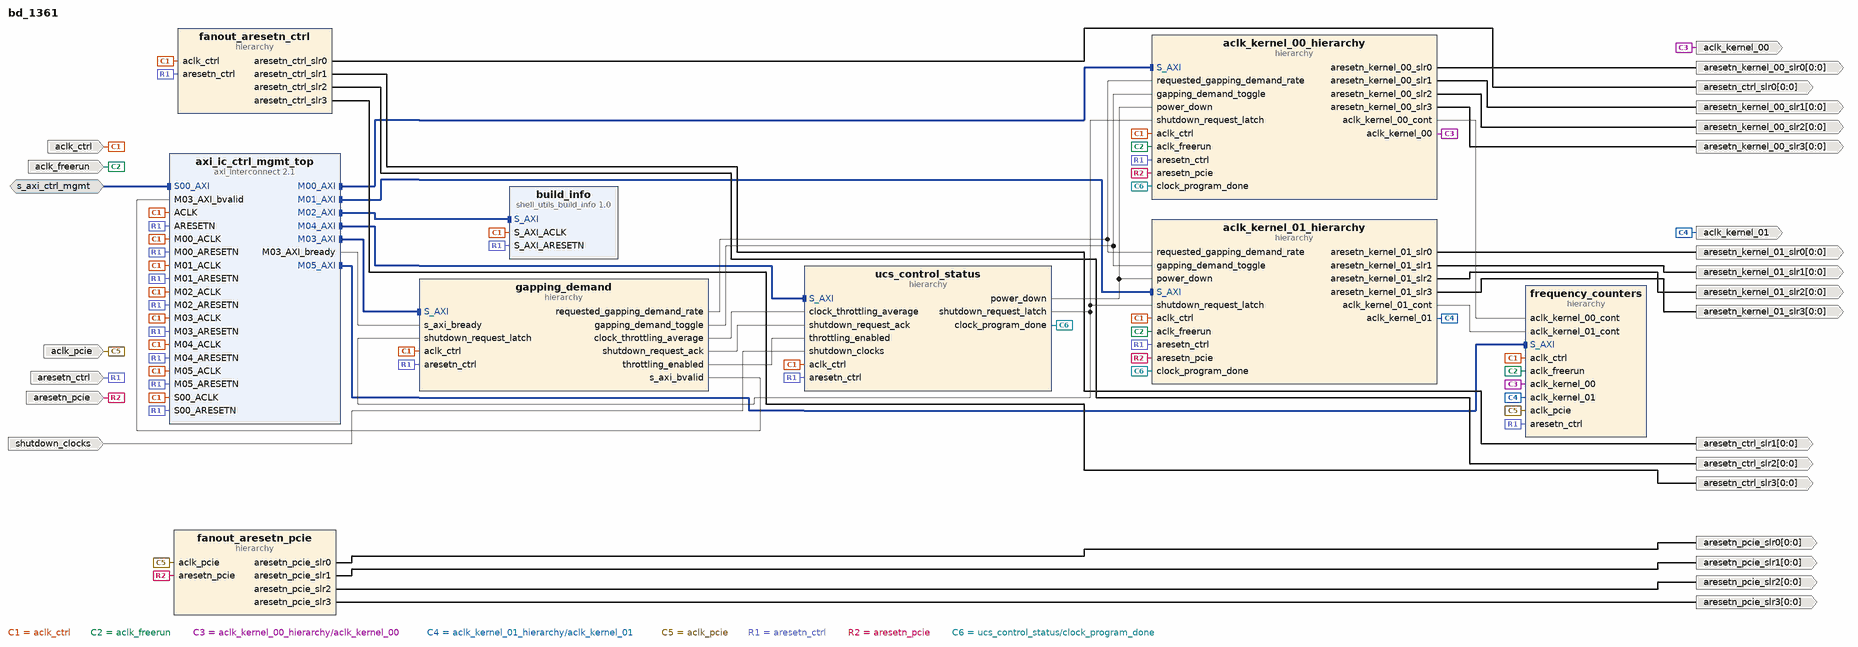
[diagram p0: block diagram of the top level]
# Vivado block design bd_1361, xcu250-figd2104-2L-e, Vivado 2022.2
create_bd_design bd_1361

create_bd_intf_port -mode Slave -vlnv xilinx.com:interface:aximm_rtl:1.0 s_axi_ctrl_mgmt
set_property -dict [list \
  CONFIG.ADDR_WIDTH 24 \
  CONFIG.DATA_WIDTH 32 \
  CONFIG.INSERT_VIP 1 \
  CONFIG.MAX_BURST_LENGTH 1 \
  CONFIG.PROTOCOL AXI4LITE \
  CONFIG.SUPPORTS_NARROW_BURST 0 \
] [get_bd_intf_ports s_axi_ctrl_mgmt]
create_bd_port -dir I -type clk aclk_freerun
set_property -dict {CONFIG.FREQ_HZ 100000000} [get_bd_ports aclk_freerun]
create_bd_port -dir I -type clk aclk_ctrl
set_property -dict [list \
  CONFIG.ASSOCIATED_BUSIF s_axi_ctrl_mgmt \
  CONFIG.ASSOCIATED_RESET aresetn_ctrl:aresetn_ctrl_slr0:aresetn_ctrl_slr1:aresetn_ctrl_slr2:aresetn_ctrl_slr3 \
] [get_bd_ports aclk_ctrl]
create_bd_port -dir I -type clk aclk_pcie
set_property -dict [list \
  CONFIG.ASSOCIATED_RESET aresetn_pcie:aresetn_pcie_slr0:aresetn_pcie_slr1:aresetn_pcie_slr2:aresetn_pcie_slr3 \
  CONFIG.FREQ_HZ 250000000 \
] [get_bd_ports aclk_pcie]
create_bd_port -dir O -type clk aclk_kernel_00
set_property -dict [list \
  CONFIG.ASSOCIATED_RESET aresetn_kernel_00_slr0:aresetn_kernel_00_slr1:aresetn_kernel_00_slr2:aresetn_kernel_00_slr3 \
] [get_bd_ports aclk_kernel_00]
create_bd_port -dir O -type clk aclk_kernel_01
set_property -dict [list \
  CONFIG.ASSOCIATED_RESET aresetn_kernel_01_slr0:aresetn_kernel_01_slr1:aresetn_kernel_01_slr2:aresetn_kernel_01_slr3 \
] [get_bd_ports aclk_kernel_01]
create_bd_port -dir I -type rst aresetn_ctrl
create_bd_port -dir I -type rst aresetn_pcie
create_bd_port -dir O -from 0 -to 0 -type rst aresetn_ctrl_slr0
create_bd_port -dir O -from 0 -to 0 -type rst aresetn_ctrl_slr1
create_bd_port -dir O -from 0 -to 0 -type rst aresetn_ctrl_slr2
create_bd_port -dir O -from 0 -to 0 -type rst aresetn_ctrl_slr3
create_bd_port -dir O -from 0 -to 0 -type rst aresetn_pcie_slr0
create_bd_port -dir O -from 0 -to 0 -type rst aresetn_pcie_slr1
create_bd_port -dir O -from 0 -to 0 -type rst aresetn_pcie_slr2
create_bd_port -dir O -from 0 -to 0 -type rst aresetn_pcie_slr3
create_bd_port -dir O -from 0 -to 0 -type rst aresetn_kernel_00_slr0
create_bd_port -dir O -from 0 -to 0 -type rst aresetn_kernel_00_slr1
create_bd_port -dir O -from 0 -to 0 -type rst aresetn_kernel_00_slr2
create_bd_port -dir O -from 0 -to 0 -type rst aresetn_kernel_00_slr3
create_bd_port -dir O -from 0 -to 0 -type rst aresetn_kernel_01_slr0
create_bd_port -dir O -from 0 -to 0 -type rst aresetn_kernel_01_slr1
create_bd_port -dir O -from 0 -to 0 -type rst aresetn_kernel_01_slr2
create_bd_port -dir O -from 0 -to 0 -type rst aresetn_kernel_01_slr3
create_bd_port -dir I shutdown_clocks

create_bd_cell -type ip -vlnv xilinx.com:ip:axi_interconnect:2.1 axi_ic_ctrl_mgmt_top
set_property -dict {CONFIG.NUM_MI 6} [get_bd_cells axi_ic_ctrl_mgmt_top]
create_bd_cell -type ip -vlnv xilinx.com:ip:shell_utils_build_info:1.0 build_info
set_property -dict [list \
  CONFIG.C_CORE_REVISION 5 \
  CONFIG.C_MAJOR_VERSION 3 \
  CONFIG.C_MINOR_VERSION 0 \
  CONFIG.C_PATCH_REVISION 0 \
  CONFIG.C_PERFORCE_CL 3478949 \
  CONFIG.C_RESERVED_TAG 0x00000000 \
  CONFIG.C_SUBSYSTEM_ID 0x07 \
  CONFIG.C_VIV_VERSION 0x202210 \
] [get_bd_cells build_info]
create_bd_cell -type hier gapping_demand
create_bd_cell -type hier ucs_control_status
create_bd_cell -type hier fanout_aresetn_pcie
create_bd_cell -type hier fanout_aresetn_ctrl
create_bd_cell -type hier frequency_counters
create_bd_cell -type hier aclk_kernel_00_hierarchy
create_bd_cell -type hier aclk_kernel_01_hierarchy

# ---- hierarchy /gapping_demand ----
current_bd_instance /gapping_demand
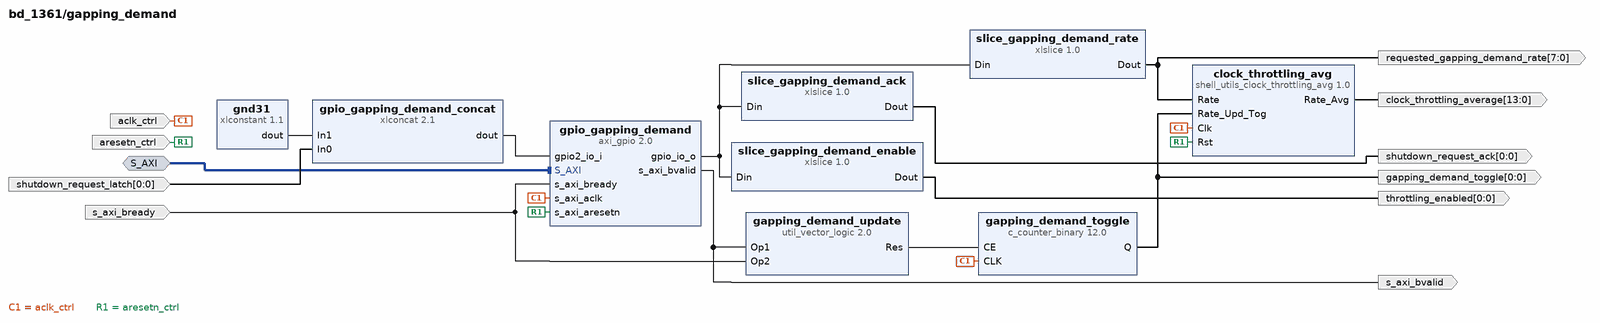
[diagram p1: block diagram inside /gapping_demand]
create_bd_intf_pin -mode Slave -vlnv xilinx.com:interface:aximm_rtl:1.0 S_AXI
create_bd_pin -dir I -type clk aclk_ctrl
create_bd_pin -dir I -type rst aresetn_ctrl
create_bd_pin -dir I s_axi_bready
create_bd_pin -dir O -from 0 -to 0 -type data gapping_demand_toggle
create_bd_pin -dir O -from 7 -to 0 requested_gapping_demand_rate
create_bd_pin -dir O s_axi_bvalid
create_bd_pin -dir O -from 13 -to 0 clock_throttling_average
create_bd_pin -dir I -from 0 -to 0 shutdown_request_latch
create_bd_pin -dir O -from 0 -to 0 shutdown_request_ack
create_bd_pin -dir O -from 0 -to 0 throttling_enabled

create_bd_cell -type ip -vlnv xilinx.com:ip:c_counter_binary:12.0 gapping_demand_toggle
set_property -dict {CONFIG.CE true CONFIG.Output_Width 1} [get_bd_cells gapping_demand_toggle]
create_bd_cell -type ip -vlnv xilinx.com:ip:util_vector_logic:2.0 gapping_demand_update
set_property -dict {CONFIG.C_SIZE 1} [get_bd_cells gapping_demand_update]
create_bd_cell -type ip -vlnv xilinx.com:ip:xlconstant:1.1 gnd31
set_property -dict {CONFIG.CONST_WIDTH 31} [get_bd_cells gnd31]
create_bd_cell -type ip -vlnv xilinx.com:ip:axi_gpio:2.0 gpio_gapping_demand
set_property -dict [list \
  CONFIG.C_ALL_INPUTS_2 1 \
  CONFIG.C_ALL_OUTPUTS 1 \
  CONFIG.C_DOUT_DEFAULT 0x000000FF \
  CONFIG.C_IS_DUAL 1 \
] [get_bd_cells gpio_gapping_demand]
create_bd_cell -type ip -vlnv xilinx.com:ip:xlconcat:2.1 gpio_gapping_demand_concat
set_property -dict {CONFIG.IN0_WIDTH 1 CONFIG.IN1_WIDTH 31 CONFIG.NUM_PORTS 2} [get_bd_cells gpio_gapping_demand_concat]
create_bd_cell -type ip -vlnv xilinx.com:ip:xlslice:1.0 slice_gapping_demand_rate
set_property -dict {CONFIG.DIN_FROM 7 CONFIG.DIN_TO 0 CONFIG.DOUT_WIDTH 8} [get_bd_cells slice_gapping_demand_rate]
create_bd_cell -type ip -vlnv xilinx.com:ip:xlslice:1.0 slice_gapping_demand_ack
set_property -dict {CONFIG.DIN_FROM 16 CONFIG.DIN_TO 16 CONFIG.DOUT_WIDTH 1} [get_bd_cells slice_gapping_demand_ack]
create_bd_cell -type ip -vlnv xilinx.com:ip:xlslice:1.0 slice_gapping_demand_enable
set_property -dict {CONFIG.DIN_FROM 20 CONFIG.DIN_TO 20 CONFIG.DOUT_WIDTH 1} [get_bd_cells slice_gapping_demand_enable]
create_bd_cell -type ip -vlnv xilinx.com:ip:shell_utils_clock_throttling_avg:1.0 clock_throttling_avg

# ---- hierarchy /ucs_control_status ----
current_bd_instance /ucs_control_status
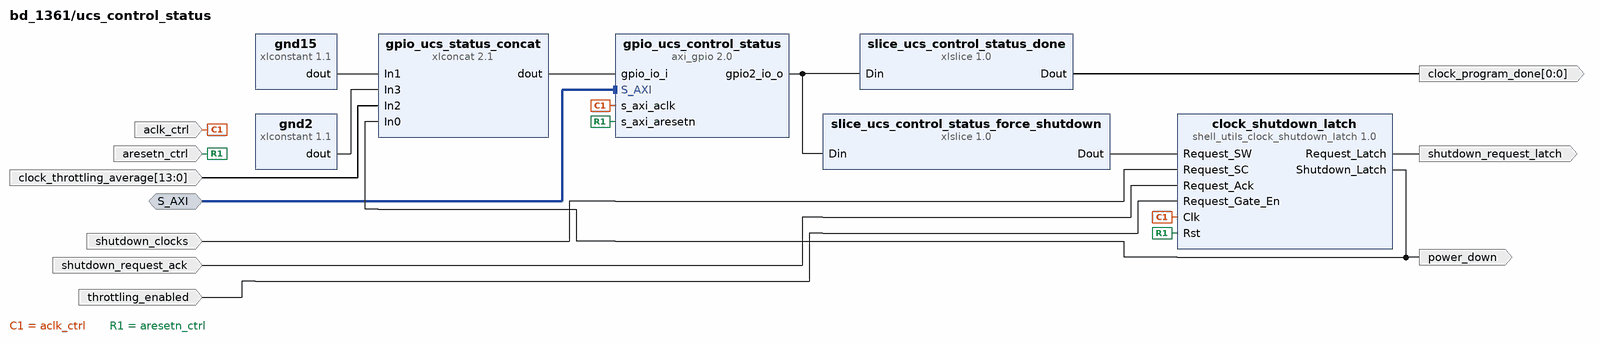
[diagram p2: block diagram inside /ucs_control_status]
create_bd_intf_pin -mode Slave -vlnv xilinx.com:interface:aximm_rtl:1.0 S_AXI
create_bd_pin -dir I -type clk aclk_ctrl
create_bd_pin -dir I -type rst aresetn_ctrl
create_bd_pin -dir I -from 13 -to 0 clock_throttling_average
create_bd_pin -dir O -from 0 -to 0 clock_program_done
create_bd_pin -dir I shutdown_clocks
create_bd_pin -dir I shutdown_request_ack
create_bd_pin -dir I throttling_enabled
create_bd_pin -dir O power_down
create_bd_pin -dir O shutdown_request_latch

create_bd_cell -type ip -vlnv xilinx.com:ip:xlconstant:1.1 gnd2
set_property -dict {CONFIG.CONST_VAL 0 CONFIG.CONST_WIDTH 2} [get_bd_cells gnd2]
create_bd_cell -type ip -vlnv xilinx.com:ip:xlconstant:1.1 gnd15
set_property -dict {CONFIG.CONST_VAL 0 CONFIG.CONST_WIDTH 15} [get_bd_cells gnd15]
create_bd_cell -type ip -vlnv xilinx.com:ip:axi_gpio:2.0 gpio_ucs_control_status
set_property -dict {CONFIG.C_ALL_INPUTS 1 CONFIG.C_ALL_OUTPUTS_2 1 CONFIG.C_IS_DUAL 1} [get_bd_cells gpio_ucs_control_status]
create_bd_cell -type ip -vlnv xilinx.com:ip:xlconcat:2.1 gpio_ucs_status_concat
set_property -dict [list \
  CONFIG.IN0_WIDTH 1 \
  CONFIG.IN1_WIDTH 15 \
  CONFIG.IN2_WIDTH 14 \
  CONFIG.IN3_WIDTH 2 \
  CONFIG.NUM_PORTS 4 \
] [get_bd_cells gpio_ucs_status_concat]
create_bd_cell -type ip -vlnv xilinx.com:ip:xlslice:1.0 slice_ucs_control_status_done
set_property -dict {CONFIG.DIN_FROM 0 CONFIG.DIN_TO 0 CONFIG.DOUT_WIDTH 1} [get_bd_cells slice_ucs_control_status_done]
create_bd_cell -type ip -vlnv xilinx.com:ip:shell_utils_clock_shutdown_latch:1.0 clock_shutdown_latch
create_bd_cell -type ip -vlnv xilinx.com:ip:xlslice:1.0 slice_ucs_control_status_force_shutdown
set_property -dict [list \
  CONFIG.DIN_FROM 20 \
  CONFIG.DIN_TO 5 \
  CONFIG.DOUT_WIDTH 16 \
] [get_bd_cells slice_ucs_control_status_force_shutdown]

# ---- hierarchy /fanout_aresetn_pcie ----
current_bd_instance /fanout_aresetn_pcie
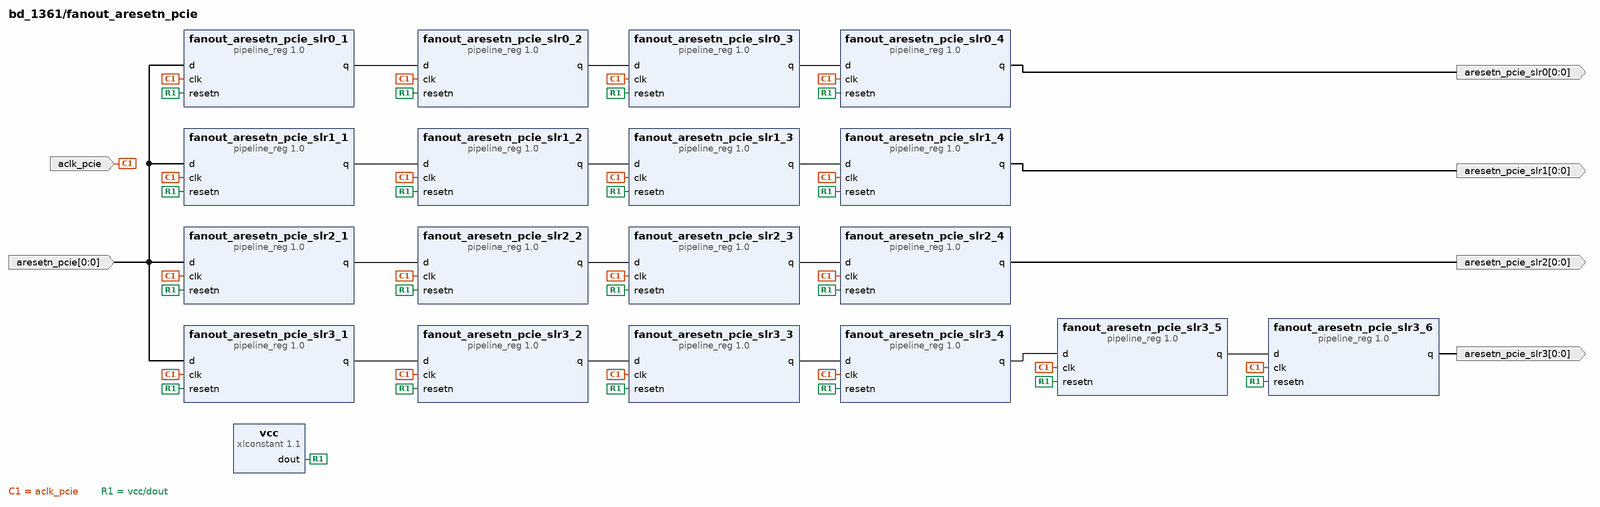
[diagram p3: block diagram inside /fanout_aresetn_pcie]
create_bd_pin -dir I -type clk aclk_pcie
create_bd_pin -dir I -from 0 -to 0 aresetn_pcie
create_bd_pin -dir O -from 0 -to 0 aresetn_pcie_slr0
create_bd_pin -dir O -from 0 -to 0 aresetn_pcie_slr1
create_bd_pin -dir O -from 0 -to 0 aresetn_pcie_slr2
create_bd_pin -dir O -from 0 -to 0 aresetn_pcie_slr3

create_bd_cell -type ip -vlnv xilinx.com:ip:pipeline_reg:1.0 fanout_aresetn_pcie_slr0_1
create_bd_cell -type ip -vlnv xilinx.com:ip:pipeline_reg:1.0 fanout_aresetn_pcie_slr0_2
create_bd_cell -type ip -vlnv xilinx.com:ip:pipeline_reg:1.0 fanout_aresetn_pcie_slr0_3
create_bd_cell -type ip -vlnv xilinx.com:ip:pipeline_reg:1.0 fanout_aresetn_pcie_slr0_4
create_bd_cell -type ip -vlnv xilinx.com:ip:pipeline_reg:1.0 fanout_aresetn_pcie_slr1_1
create_bd_cell -type ip -vlnv xilinx.com:ip:pipeline_reg:1.0 fanout_aresetn_pcie_slr1_2
create_bd_cell -type ip -vlnv xilinx.com:ip:pipeline_reg:1.0 fanout_aresetn_pcie_slr1_3
create_bd_cell -type ip -vlnv xilinx.com:ip:pipeline_reg:1.0 fanout_aresetn_pcie_slr1_4
create_bd_cell -type ip -vlnv xilinx.com:ip:pipeline_reg:1.0 fanout_aresetn_pcie_slr2_1
create_bd_cell -type ip -vlnv xilinx.com:ip:pipeline_reg:1.0 fanout_aresetn_pcie_slr2_2
create_bd_cell -type ip -vlnv xilinx.com:ip:pipeline_reg:1.0 fanout_aresetn_pcie_slr2_3
create_bd_cell -type ip -vlnv xilinx.com:ip:pipeline_reg:1.0 fanout_aresetn_pcie_slr2_4
create_bd_cell -type ip -vlnv xilinx.com:ip:pipeline_reg:1.0 fanout_aresetn_pcie_slr3_1
create_bd_cell -type ip -vlnv xilinx.com:ip:pipeline_reg:1.0 fanout_aresetn_pcie_slr3_2
create_bd_cell -type ip -vlnv xilinx.com:ip:pipeline_reg:1.0 fanout_aresetn_pcie_slr3_3
create_bd_cell -type ip -vlnv xilinx.com:ip:pipeline_reg:1.0 fanout_aresetn_pcie_slr3_4
create_bd_cell -type ip -vlnv xilinx.com:ip:pipeline_reg:1.0 fanout_aresetn_pcie_slr3_5
create_bd_cell -type ip -vlnv xilinx.com:ip:pipeline_reg:1.0 fanout_aresetn_pcie_slr3_6
create_bd_cell -type ip -vlnv xilinx.com:ip:xlconstant:1.1 vcc
set_property -dict {CONFIG.CONST_VAL 1} [get_bd_cells vcc]

# ---- hierarchy /fanout_aresetn_ctrl ----
current_bd_instance /fanout_aresetn_ctrl
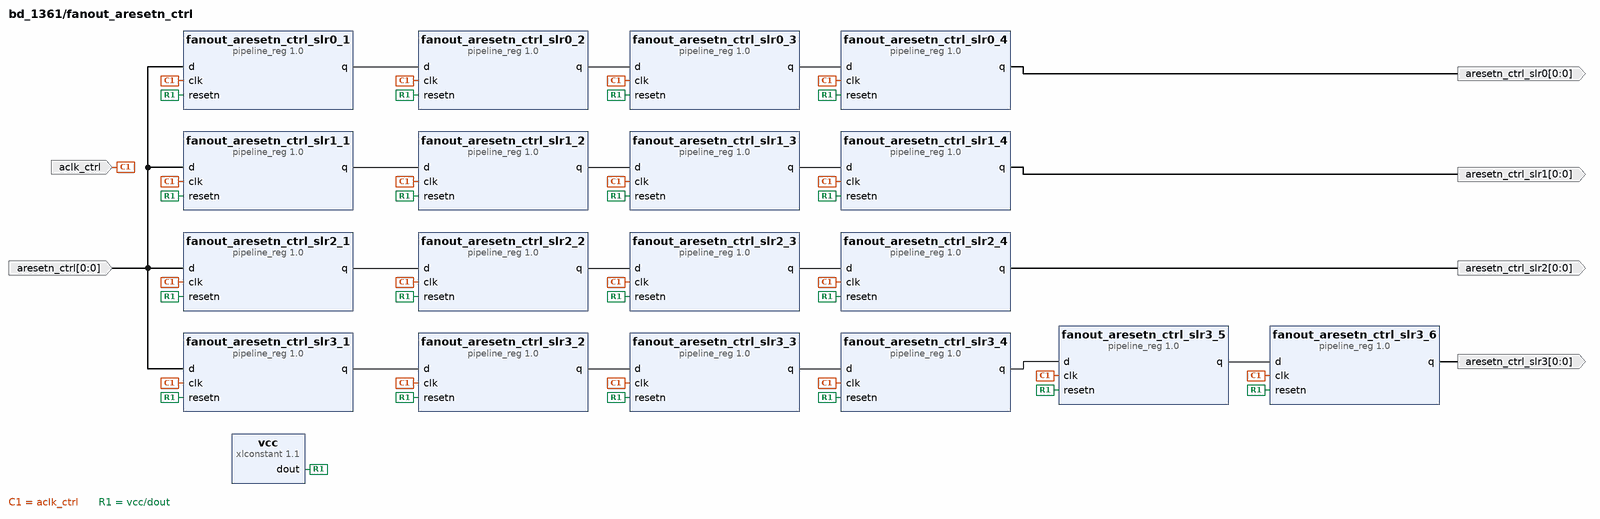
[diagram p4: block diagram inside /fanout_aresetn_ctrl]
create_bd_pin -dir I -type clk aclk_ctrl
create_bd_pin -dir I -from 0 -to 0 aresetn_ctrl
create_bd_pin -dir O -from 0 -to 0 aresetn_ctrl_slr0
create_bd_pin -dir O -from 0 -to 0 aresetn_ctrl_slr1
create_bd_pin -dir O -from 0 -to 0 aresetn_ctrl_slr2
create_bd_pin -dir O -from 0 -to 0 aresetn_ctrl_slr3

create_bd_cell -type ip -vlnv xilinx.com:ip:pipeline_reg:1.0 fanout_aresetn_ctrl_slr0_1
create_bd_cell -type ip -vlnv xilinx.com:ip:pipeline_reg:1.0 fanout_aresetn_ctrl_slr0_2
create_bd_cell -type ip -vlnv xilinx.com:ip:pipeline_reg:1.0 fanout_aresetn_ctrl_slr0_3
create_bd_cell -type ip -vlnv xilinx.com:ip:pipeline_reg:1.0 fanout_aresetn_ctrl_slr0_4
create_bd_cell -type ip -vlnv xilinx.com:ip:pipeline_reg:1.0 fanout_aresetn_ctrl_slr1_1
create_bd_cell -type ip -vlnv xilinx.com:ip:pipeline_reg:1.0 fanout_aresetn_ctrl_slr1_2
create_bd_cell -type ip -vlnv xilinx.com:ip:pipeline_reg:1.0 fanout_aresetn_ctrl_slr1_3
create_bd_cell -type ip -vlnv xilinx.com:ip:pipeline_reg:1.0 fanout_aresetn_ctrl_slr1_4
create_bd_cell -type ip -vlnv xilinx.com:ip:pipeline_reg:1.0 fanout_aresetn_ctrl_slr2_1
create_bd_cell -type ip -vlnv xilinx.com:ip:pipeline_reg:1.0 fanout_aresetn_ctrl_slr2_2
create_bd_cell -type ip -vlnv xilinx.com:ip:pipeline_reg:1.0 fanout_aresetn_ctrl_slr2_3
create_bd_cell -type ip -vlnv xilinx.com:ip:pipeline_reg:1.0 fanout_aresetn_ctrl_slr2_4
create_bd_cell -type ip -vlnv xilinx.com:ip:pipeline_reg:1.0 fanout_aresetn_ctrl_slr3_1
create_bd_cell -type ip -vlnv xilinx.com:ip:pipeline_reg:1.0 fanout_aresetn_ctrl_slr3_2
create_bd_cell -type ip -vlnv xilinx.com:ip:pipeline_reg:1.0 fanout_aresetn_ctrl_slr3_3
create_bd_cell -type ip -vlnv xilinx.com:ip:pipeline_reg:1.0 fanout_aresetn_ctrl_slr3_4
create_bd_cell -type ip -vlnv xilinx.com:ip:pipeline_reg:1.0 fanout_aresetn_ctrl_slr3_5
create_bd_cell -type ip -vlnv xilinx.com:ip:pipeline_reg:1.0 fanout_aresetn_ctrl_slr3_6
create_bd_cell -type ip -vlnv xilinx.com:ip:xlconstant:1.1 vcc
set_property -dict {CONFIG.CONST_VAL 1} [get_bd_cells vcc]

# ---- hierarchy /frequency_counters ----
current_bd_instance /frequency_counters
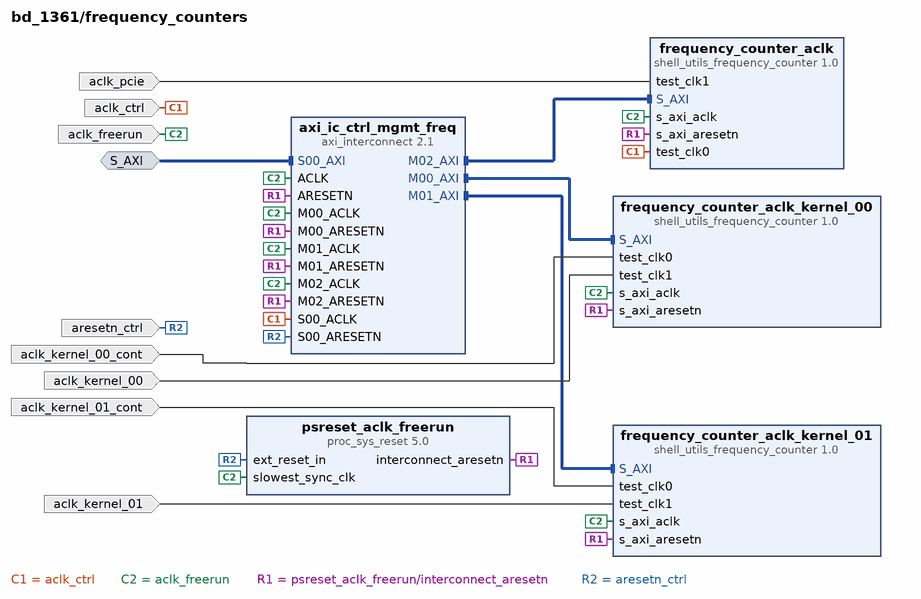
[diagram p5: block diagram inside /frequency_counters]
create_bd_intf_pin -mode Slave -vlnv xilinx.com:interface:aximm_rtl:1.0 S_AXI
create_bd_pin -dir I -type clk aclk_freerun
create_bd_pin -dir I aclk_ctrl
create_bd_pin -dir I aclk_pcie
create_bd_pin -dir I -type rst aresetn_ctrl
create_bd_pin -dir I aclk_kernel_00
create_bd_pin -dir I aclk_kernel_00_cont
create_bd_pin -dir I aclk_kernel_01
create_bd_pin -dir I aclk_kernel_01_cont

create_bd_cell -type ip -vlnv xilinx.com:ip:axi_interconnect:2.1 axi_ic_ctrl_mgmt_freq
set_property -dict {CONFIG.NUM_MI 3} [get_bd_cells axi_ic_ctrl_mgmt_freq]
create_bd_cell -type ip -vlnv xilinx.com:ip:shell_utils_frequency_counter:1.0 frequency_counter_aclk
set_property -dict [list \
  CONFIG.REF_CLK_FREQ_HZ 100000 \
  CONFIG.TEST_CLK_0_TYPE 5 \
  CONFIG.TEST_CLK_1_TYPE 6 \
  CONFIG.TEST_CLK_2_TYPE 0 \
  CONFIG.TEST_CLK_3_TYPE 0 \
] [get_bd_cells frequency_counter_aclk]
create_bd_cell -type ip -vlnv xilinx.com:ip:shell_utils_frequency_counter:1.0 frequency_counter_aclk_kernel_00
set_property -dict [list \
  CONFIG.REF_CLK_FREQ_HZ 100000 \
  CONFIG.TEST_CLK_0_TYPE 1 \
  CONFIG.TEST_CLK_1_TYPE 2 \
  CONFIG.TEST_CLK_2_TYPE 0 \
  CONFIG.TEST_CLK_3_TYPE 0 \
] [get_bd_cells frequency_counter_aclk_kernel_00]
create_bd_cell -type ip -vlnv xilinx.com:ip:shell_utils_frequency_counter:1.0 frequency_counter_aclk_kernel_01
set_property -dict [list \
  CONFIG.REF_CLK_FREQ_HZ 100000 \
  CONFIG.TEST_CLK_0_TYPE 1 \
  CONFIG.TEST_CLK_1_TYPE 2 \
  CONFIG.TEST_CLK_2_TYPE 0 \
  CONFIG.TEST_CLK_3_TYPE 0 \
] [get_bd_cells frequency_counter_aclk_kernel_01]
create_bd_cell -type ip -vlnv xilinx.com:ip:proc_sys_reset:5.0 psreset_aclk_freerun
set_property -dict {CONFIG.C_AUX_RST_WIDTH 1 CONFIG.C_EXT_RST_WIDTH 1} [get_bd_cells psreset_aclk_freerun]

# ---- hierarchy /aclk_kernel_00_hierarchy ----
current_bd_instance /aclk_kernel_00_hierarchy
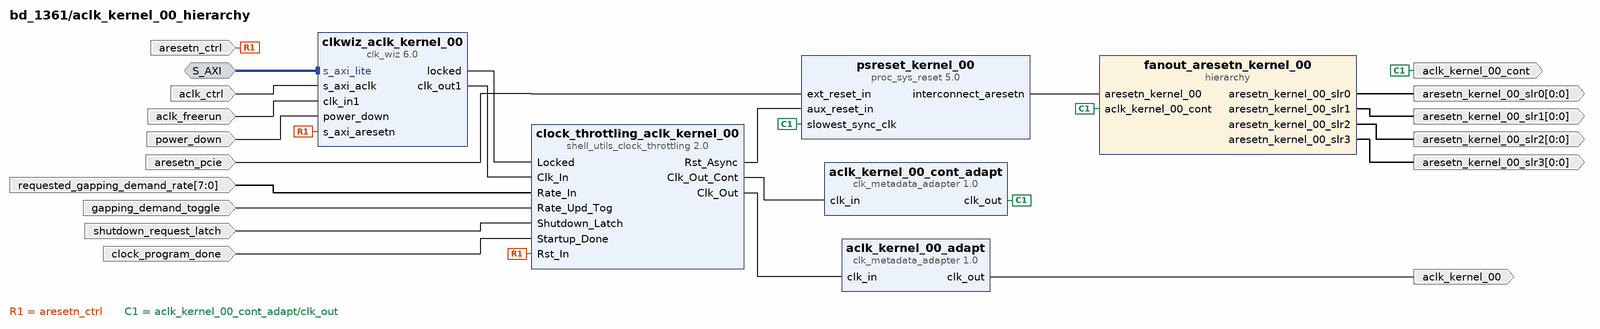
[diagram p6: block diagram inside /aclk_kernel_00_hierarchy]
create_bd_intf_pin -mode Slave -vlnv xilinx.com:interface:aximm_rtl:1.0 S_AXI
create_bd_pin -dir I clock_program_done
create_bd_pin -dir I shutdown_request_latch
create_bd_pin -dir I -from 7 -to 0 requested_gapping_demand_rate
create_bd_pin -dir I gapping_demand_toggle
create_bd_pin -dir O -type clk aclk_kernel_00_cont
create_bd_pin -dir I -type clk aclk_ctrl
create_bd_pin -dir I -type rst aresetn_ctrl
create_bd_pin -dir I -type rst aresetn_pcie
create_bd_pin -dir I -type clk aclk_freerun
create_bd_pin -dir I power_down
create_bd_pin -dir O -type clk aclk_kernel_00
create_bd_pin -dir O -from 0 -to 0 aresetn_kernel_00_slr0
create_bd_pin -dir O -from 0 -to 0 aresetn_kernel_00_slr1
create_bd_pin -dir O -from 0 -to 0 aresetn_kernel_00_slr2
create_bd_pin -dir O -from 0 -to 0 aresetn_kernel_00_slr3

create_bd_cell -type ip -vlnv xilinx.com:ip:clk_metadata_adapter:1.0 aclk_kernel_00_adapt
set_property -dict {CONFIG.CLK_DOMAIN cd_aclk_kernel_00} [get_bd_cells aclk_kernel_00_adapt]
create_bd_cell -type ip -vlnv xilinx.com:ip:clk_metadata_adapter:1.0 aclk_kernel_00_cont_adapt
set_property -dict {CONFIG.CLK_DOMAIN cd_aclk_kernel_00} [get_bd_cells aclk_kernel_00_cont_adapt]
create_bd_cell -type ip -vlnv xilinx.com:ip:clk_wiz:6.0 clkwiz_aclk_kernel_00
set_property -dict [list \
  CONFIG.CLKOUT1_DRIVES No_buffer \
  CONFIG.CLKOUT1_REQUESTED_OUT_FREQ 300 \
  CONFIG.PRIM_SOURCE No_buffer \
  CONFIG.USE_DYN_RECONFIG true \
  CONFIG.USE_POWER_DOWN true \
] [get_bd_cells clkwiz_aclk_kernel_00]
create_bd_cell -type ip -vlnv xilinx.com:ip:shell_utils_clock_throttling:2.0 clock_throttling_aclk_kernel_00
set_property -dict {CONFIG.CLK_SLOW_DIV 1} [get_bd_cells clock_throttling_aclk_kernel_00]
create_bd_cell -type hier fanout_aresetn_kernel_00
create_bd_cell -type ip -vlnv xilinx.com:ip:proc_sys_reset:5.0 psreset_kernel_00
set_property -dict {CONFIG.C_AUX_RST_WIDTH 1 CONFIG.C_EXT_RST_WIDTH 1} [get_bd_cells psreset_kernel_00]

# ---- hierarchy /aclk_kernel_00_hierarchy/fanout_aresetn_kernel_00 ----
current_bd_instance /aclk_kernel_00_hierarchy/fanout_aresetn_kernel_00
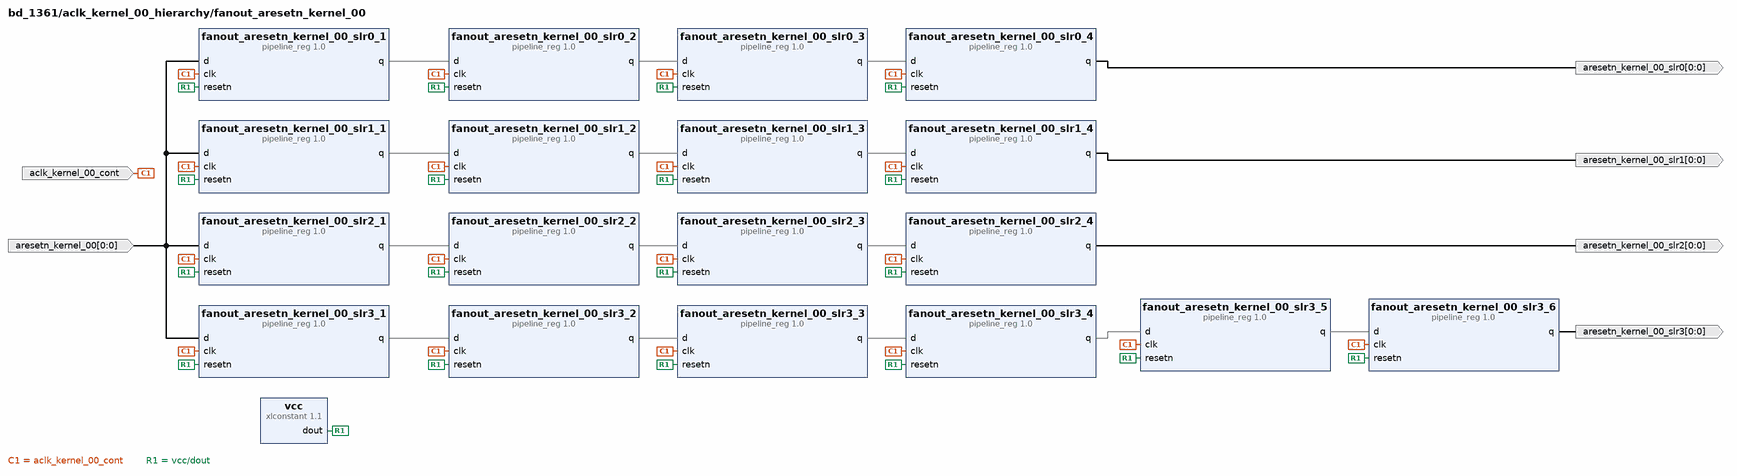
[diagram p7: block diagram inside /aclk_kernel_00_hierarchy/fanout_aresetn_kernel_00]
create_bd_pin -dir I -type clk aclk_kernel_00_cont
create_bd_pin -dir I -from 0 -to 0 aresetn_kernel_00
create_bd_pin -dir O -from 0 -to 0 aresetn_kernel_00_slr0
create_bd_pin -dir O -from 0 -to 0 aresetn_kernel_00_slr1
create_bd_pin -dir O -from 0 -to 0 aresetn_kernel_00_slr2
create_bd_pin -dir O -from 0 -to 0 aresetn_kernel_00_slr3

create_bd_cell -type ip -vlnv xilinx.com:ip:pipeline_reg:1.0 fanout_aresetn_kernel_00_slr0_1
create_bd_cell -type ip -vlnv xilinx.com:ip:pipeline_reg:1.0 fanout_aresetn_kernel_00_slr0_2
create_bd_cell -type ip -vlnv xilinx.com:ip:pipeline_reg:1.0 fanout_aresetn_kernel_00_slr0_3
create_bd_cell -type ip -vlnv xilinx.com:ip:pipeline_reg:1.0 fanout_aresetn_kernel_00_slr0_4
create_bd_cell -type ip -vlnv xilinx.com:ip:pipeline_reg:1.0 fanout_aresetn_kernel_00_slr1_1
create_bd_cell -type ip -vlnv xilinx.com:ip:pipeline_reg:1.0 fanout_aresetn_kernel_00_slr1_2
create_bd_cell -type ip -vlnv xilinx.com:ip:pipeline_reg:1.0 fanout_aresetn_kernel_00_slr1_3
create_bd_cell -type ip -vlnv xilinx.com:ip:pipeline_reg:1.0 fanout_aresetn_kernel_00_slr1_4
create_bd_cell -type ip -vlnv xilinx.com:ip:pipeline_reg:1.0 fanout_aresetn_kernel_00_slr2_1
create_bd_cell -type ip -vlnv xilinx.com:ip:pipeline_reg:1.0 fanout_aresetn_kernel_00_slr2_2
create_bd_cell -type ip -vlnv xilinx.com:ip:pipeline_reg:1.0 fanout_aresetn_kernel_00_slr2_3
create_bd_cell -type ip -vlnv xilinx.com:ip:pipeline_reg:1.0 fanout_aresetn_kernel_00_slr2_4
create_bd_cell -type ip -vlnv xilinx.com:ip:pipeline_reg:1.0 fanout_aresetn_kernel_00_slr3_1
create_bd_cell -type ip -vlnv xilinx.com:ip:pipeline_reg:1.0 fanout_aresetn_kernel_00_slr3_2
create_bd_cell -type ip -vlnv xilinx.com:ip:pipeline_reg:1.0 fanout_aresetn_kernel_00_slr3_3
create_bd_cell -type ip -vlnv xilinx.com:ip:pipeline_reg:1.0 fanout_aresetn_kernel_00_slr3_4
create_bd_cell -type ip -vlnv xilinx.com:ip:pipeline_reg:1.0 fanout_aresetn_kernel_00_slr3_5
create_bd_cell -type ip -vlnv xilinx.com:ip:pipeline_reg:1.0 fanout_aresetn_kernel_00_slr3_6
create_bd_cell -type ip -vlnv xilinx.com:ip:xlconstant:1.1 vcc
set_property -dict {CONFIG.CONST_VAL 1} [get_bd_cells vcc]

# ---- hierarchy /aclk_kernel_01_hierarchy ----
current_bd_instance /aclk_kernel_01_hierarchy
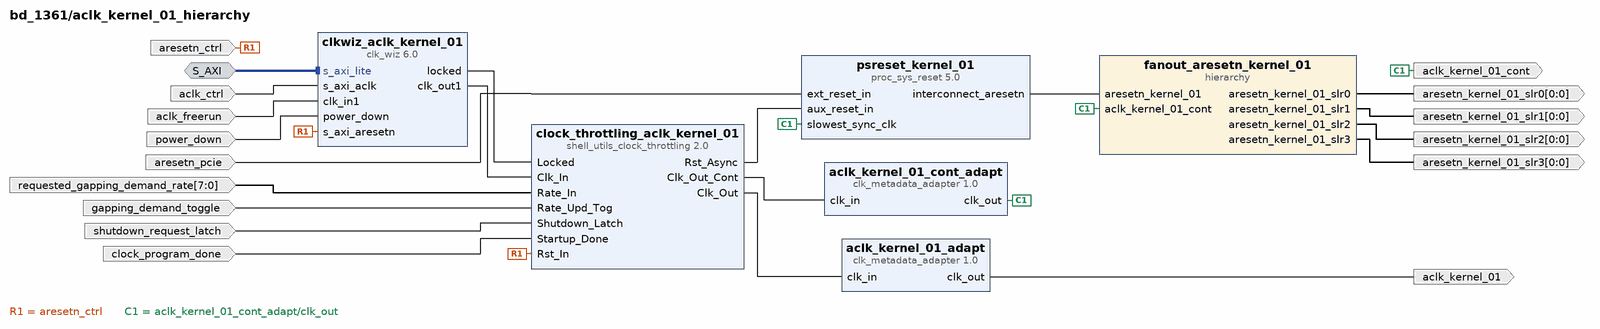
[diagram p8: block diagram inside /aclk_kernel_01_hierarchy]
create_bd_intf_pin -mode Slave -vlnv xilinx.com:interface:aximm_rtl:1.0 S_AXI
create_bd_pin -dir I clock_program_done
create_bd_pin -dir I shutdown_request_latch
create_bd_pin -dir I -from 7 -to 0 requested_gapping_demand_rate
create_bd_pin -dir I gapping_demand_toggle
create_bd_pin -dir O -type clk aclk_kernel_01_cont
create_bd_pin -dir I -type clk aclk_ctrl
create_bd_pin -dir I -type rst aresetn_ctrl
create_bd_pin -dir I -type rst aresetn_pcie
create_bd_pin -dir I -type clk aclk_freerun
create_bd_pin -dir I power_down
create_bd_pin -dir O -type clk aclk_kernel_01
create_bd_pin -dir O -from 0 -to 0 aresetn_kernel_01_slr0
create_bd_pin -dir O -from 0 -to 0 aresetn_kernel_01_slr1
create_bd_pin -dir O -from 0 -to 0 aresetn_kernel_01_slr2
create_bd_pin -dir O -from 0 -to 0 aresetn_kernel_01_slr3

create_bd_cell -type ip -vlnv xilinx.com:ip:clk_metadata_adapter:1.0 aclk_kernel_01_adapt
set_property -dict {CONFIG.CLK_DOMAIN cd_aclk_kernel_01} [get_bd_cells aclk_kernel_01_adapt]
create_bd_cell -type ip -vlnv xilinx.com:ip:clk_metadata_adapter:1.0 aclk_kernel_01_cont_adapt
set_property -dict {CONFIG.CLK_DOMAIN cd_aclk_kernel_01} [get_bd_cells aclk_kernel_01_cont_adapt]
create_bd_cell -type ip -vlnv xilinx.com:ip:clk_wiz:6.0 clkwiz_aclk_kernel_01
set_property -dict [list \
  CONFIG.CLKOUT1_DRIVES No_buffer \
  CONFIG.CLKOUT1_REQUESTED_OUT_FREQ 500 \
  CONFIG.PRIM_SOURCE No_buffer \
  CONFIG.USE_DYN_RECONFIG true \
  CONFIG.USE_POWER_DOWN true \
] [get_bd_cells clkwiz_aclk_kernel_01]
create_bd_cell -type ip -vlnv xilinx.com:ip:shell_utils_clock_throttling:2.0 clock_throttling_aclk_kernel_01
set_property -dict {CONFIG.CLK_SLOW_DIV 1} [get_bd_cells clock_throttling_aclk_kernel_01]
create_bd_cell -type hier fanout_aresetn_kernel_01
create_bd_cell -type ip -vlnv xilinx.com:ip:proc_sys_reset:5.0 psreset_kernel_01
set_property -dict {CONFIG.C_AUX_RST_WIDTH 1 CONFIG.C_EXT_RST_WIDTH 1} [get_bd_cells psreset_kernel_01]

# ---- hierarchy /aclk_kernel_01_hierarchy/fanout_aresetn_kernel_01 ----
current_bd_instance /aclk_kernel_01_hierarchy/fanout_aresetn_kernel_01
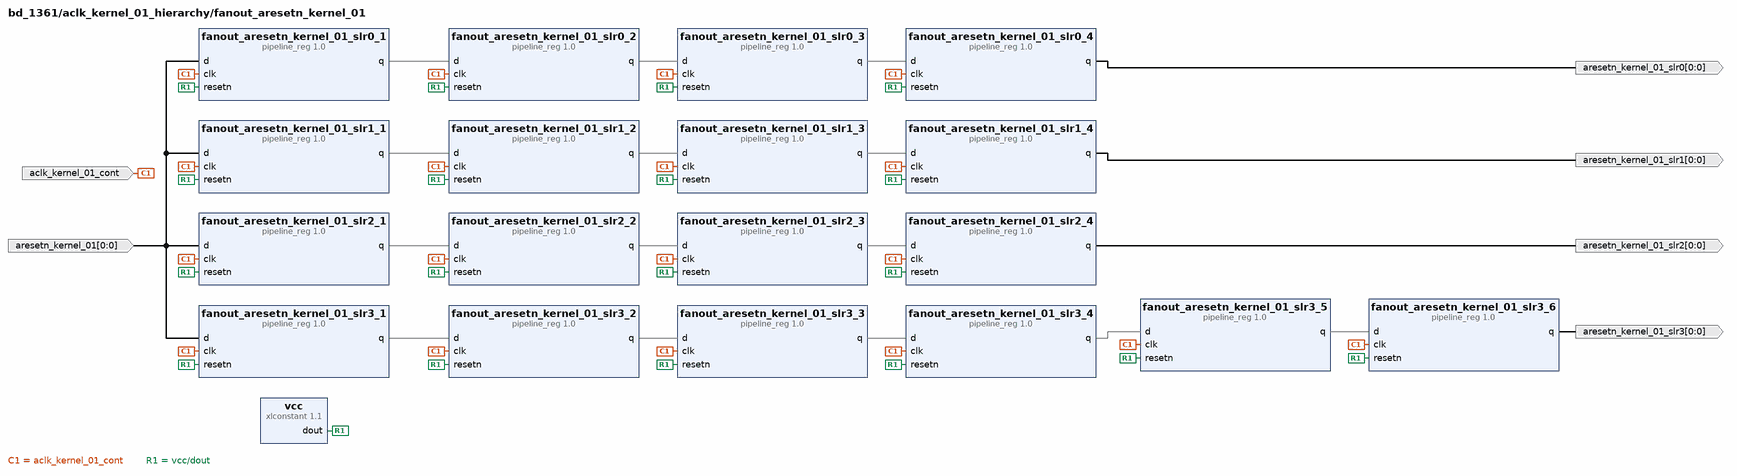
[diagram p9: block diagram inside /aclk_kernel_01_hierarchy/fanout_aresetn_kernel_01]
create_bd_pin -dir I -type clk aclk_kernel_01_cont
create_bd_pin -dir I -from 0 -to 0 aresetn_kernel_01
create_bd_pin -dir O -from 0 -to 0 aresetn_kernel_01_slr0
create_bd_pin -dir O -from 0 -to 0 aresetn_kernel_01_slr1
create_bd_pin -dir O -from 0 -to 0 aresetn_kernel_01_slr2
create_bd_pin -dir O -from 0 -to 0 aresetn_kernel_01_slr3

create_bd_cell -type ip -vlnv xilinx.com:ip:pipeline_reg:1.0 fanout_aresetn_kernel_01_slr0_1
create_bd_cell -type ip -vlnv xilinx.com:ip:pipeline_reg:1.0 fanout_aresetn_kernel_01_slr0_2
create_bd_cell -type ip -vlnv xilinx.com:ip:pipeline_reg:1.0 fanout_aresetn_kernel_01_slr0_3
create_bd_cell -type ip -vlnv xilinx.com:ip:pipeline_reg:1.0 fanout_aresetn_kernel_01_slr0_4
create_bd_cell -type ip -vlnv xilinx.com:ip:pipeline_reg:1.0 fanout_aresetn_kernel_01_slr1_1
create_bd_cell -type ip -vlnv xilinx.com:ip:pipeline_reg:1.0 fanout_aresetn_kernel_01_slr1_2
create_bd_cell -type ip -vlnv xilinx.com:ip:pipeline_reg:1.0 fanout_aresetn_kernel_01_slr1_3
create_bd_cell -type ip -vlnv xilinx.com:ip:pipeline_reg:1.0 fanout_aresetn_kernel_01_slr1_4
create_bd_cell -type ip -vlnv xilinx.com:ip:pipeline_reg:1.0 fanout_aresetn_kernel_01_slr2_1
create_bd_cell -type ip -vlnv xilinx.com:ip:pipeline_reg:1.0 fanout_aresetn_kernel_01_slr2_2
create_bd_cell -type ip -vlnv xilinx.com:ip:pipeline_reg:1.0 fanout_aresetn_kernel_01_slr2_3
create_bd_cell -type ip -vlnv xilinx.com:ip:pipeline_reg:1.0 fanout_aresetn_kernel_01_slr2_4
create_bd_cell -type ip -vlnv xilinx.com:ip:pipeline_reg:1.0 fanout_aresetn_kernel_01_slr3_1
create_bd_cell -type ip -vlnv xilinx.com:ip:pipeline_reg:1.0 fanout_aresetn_kernel_01_slr3_2
create_bd_cell -type ip -vlnv xilinx.com:ip:pipeline_reg:1.0 fanout_aresetn_kernel_01_slr3_3
create_bd_cell -type ip -vlnv xilinx.com:ip:pipeline_reg:1.0 fanout_aresetn_kernel_01_slr3_4
create_bd_cell -type ip -vlnv xilinx.com:ip:pipeline_reg:1.0 fanout_aresetn_kernel_01_slr3_5
create_bd_cell -type ip -vlnv xilinx.com:ip:pipeline_reg:1.0 fanout_aresetn_kernel_01_slr3_6
create_bd_cell -type ip -vlnv xilinx.com:ip:xlconstant:1.1 vcc
set_property -dict {CONFIG.CONST_VAL 1} [get_bd_cells vcc]

# ---- connections ----

current_bd_instance /gapping_demand
connect_bd_intf_net [get_bd_intf_pins S_AXI] [get_bd_intf_pins gpio_gapping_demand/S_AXI]
connect_bd_net [get_bd_pins aclk_ctrl] \
  [get_bd_pins gapping_demand_toggle/CLK] [get_bd_pins gpio_gapping_demand/s_axi_aclk] [get_bd_pins clock_throttling_avg/Clk]
connect_bd_net [get_bd_pins aresetn_ctrl] [get_bd_pins gpio_gapping_demand/s_axi_aresetn] [get_bd_pins clock_throttling_avg/Rst]
connect_bd_net -net clock_throttling_average_net [get_bd_pins clock_throttling_avg/Rate_Avg] [get_bd_pins clock_throttling_average]
connect_bd_net -net gapping_demand_bready_net [get_bd_pins s_axi_bready] \
  [get_bd_pins gapping_demand_update/Op2] [get_bd_pins gpio_gapping_demand/s_axi_bready]
connect_bd_net -net gapping_demand_bvalid_net [get_bd_pins gpio_gapping_demand/s_axi_bvalid] \
  [get_bd_pins s_axi_bvalid] [get_bd_pins gapping_demand_update/Op1]
connect_bd_net -net gapping_demand_net [get_bd_pins slice_gapping_demand_rate/Dout] \
  [get_bd_pins requested_gapping_demand_rate] [get_bd_pins clock_throttling_avg/Rate]
connect_bd_net -net gapping_demand_toggle_net [get_bd_pins gapping_demand_toggle/Q] \
  [get_bd_pins gapping_demand_toggle] [get_bd_pins clock_throttling_avg/Rate_Upd_Tog]
connect_bd_net -net gapping_demand_update_net [get_bd_pins gapping_demand_update/Res] [get_bd_pins gapping_demand_toggle/CE]
connect_bd_net -net gnd31_net [get_bd_pins gnd31/dout] [get_bd_pins gpio_gapping_demand_concat/In1]
connect_bd_net -net gpio_gapping_demand_conc_net [get_bd_pins gpio_gapping_demand_concat/dout] [get_bd_pins gpio_gapping_demand/gpio2_io_i]
connect_bd_net -net gpio_gapping_demand_gpio_net [get_bd_pins gpio_gapping_demand/gpio_io_o] \
  [get_bd_pins slice_gapping_demand_rate/Din] [get_bd_pins slice_gapping_demand_ack/Din] \
  [get_bd_pins slice_gapping_demand_enable/Din]
connect_bd_net -net shutdown_request_ack_net [get_bd_pins slice_gapping_demand_ack/Dout] [get_bd_pins shutdown_request_ack]
connect_bd_net -net shutdown_request_gate_en_net [get_bd_pins slice_gapping_demand_enable/Dout] [get_bd_pins throttling_enabled]
connect_bd_net -net shutdown_request_latched_net [get_bd_pins shutdown_request_latch] [get_bd_pins gpio_gapping_demand_concat/In0]

current_bd_instance /ucs_control_status
connect_bd_intf_net [get_bd_intf_pins S_AXI] [get_bd_intf_pins gpio_ucs_control_status/S_AXI]
connect_bd_net -net Request_SW_net [get_bd_pins slice_ucs_control_status_force_shutdown/Dout] [get_bd_pins clock_shutdown_latch/Request_SW]
connect_bd_net -net aclk_ctrl_net [get_bd_pins aclk_ctrl] [get_bd_pins gpio_ucs_control_status/s_axi_aclk] [get_bd_pins clock_shutdown_latch/Clk]
connect_bd_net -net aresetn_ctrl_net [get_bd_pins aresetn_ctrl] \
  [get_bd_pins gpio_ucs_control_status/s_axi_aresetn] [get_bd_pins clock_shutdown_latch/Rst]
connect_bd_net -net clock_program_done_net [get_bd_pins slice_ucs_control_status_done/Dout] [get_bd_pins clock_program_done]
connect_bd_net -net clock_throttling_average_net [get_bd_pins clock_throttling_average] [get_bd_pins gpio_ucs_status_concat/In2]
connect_bd_net -net force_shutdown_net [get_bd_pins shutdown_clocks] [get_bd_pins clock_shutdown_latch/Request_SC]
connect_bd_net -net gnd15_net [get_bd_pins gnd15/dout] [get_bd_pins gpio_ucs_status_concat/In1]
connect_bd_net -net gnd2_net [get_bd_pins gnd2/dout] [get_bd_pins gpio_ucs_status_concat/In3]
connect_bd_net -net gpio_ucs_control_status_net [get_bd_pins gpio_ucs_control_status/gpio2_io_o] \
  [get_bd_pins slice_ucs_control_status_done/Din] [get_bd_pins slice_ucs_control_status_force_shutdown/Din]
connect_bd_net -net gpio_ucs_status_concat_net [get_bd_pins gpio_ucs_status_concat/dout] [get_bd_pins gpio_ucs_control_status/gpio_io_i]
connect_bd_net -net request_ack_net [get_bd_pins shutdown_request_ack] [get_bd_pins clock_shutdown_latch/Request_Ack]
connect_bd_net -net request_gate_en_net [get_bd_pins throttling_enabled] [get_bd_pins clock_shutdown_latch/Request_Gate_En]
connect_bd_net -net request_latch_net [get_bd_pins clock_shutdown_latch/Request_Latch] [get_bd_pins shutdown_request_latch]
connect_bd_net -net shutdown_latch_net [get_bd_pins clock_shutdown_latch/Shutdown_Latch] \
  [get_bd_pins power_down] [get_bd_pins gpio_ucs_status_concat/In0]

current_bd_instance /fanout_aresetn_pcie
connect_bd_net -net aclk_pcie_net [get_bd_pins aclk_pcie] \
  [get_bd_pins fanout_aresetn_pcie_slr0_1/clk] [get_bd_pins fanout_aresetn_pcie_slr0_2/clk] \
  [get_bd_pins fanout_aresetn_pcie_slr0_3/clk] [get_bd_pins fanout_aresetn_pcie_slr0_4/clk] \
  [get_bd_pins fanout_aresetn_pcie_slr1_1/clk] [get_bd_pins fanout_aresetn_pcie_slr1_2/clk] \
  [get_bd_pins fanout_aresetn_pcie_slr1_3/clk] [get_bd_pins fanout_aresetn_pcie_slr1_4/clk] \
  [get_bd_pins fanout_aresetn_pcie_slr2_1/clk] [get_bd_pins fanout_aresetn_pcie_slr2_2/clk] \
  [get_bd_pins fanout_aresetn_pcie_slr2_3/clk] [get_bd_pins fanout_aresetn_pcie_slr2_4/clk] \
  [get_bd_pins fanout_aresetn_pcie_slr3_1/clk] [get_bd_pins fanout_aresetn_pcie_slr3_2/clk] \
  [get_bd_pins fanout_aresetn_pcie_slr3_3/clk] [get_bd_pins fanout_aresetn_pcie_slr3_4/clk] \
  [get_bd_pins fanout_aresetn_pcie_slr3_5/clk] [get_bd_pins fanout_aresetn_pcie_slr3_6/clk]
connect_bd_net -net aresetn_pcie_net [get_bd_pins aresetn_pcie] \
  [get_bd_pins fanout_aresetn_pcie_slr0_1/d] [get_bd_pins fanout_aresetn_pcie_slr1_1/d] \
  [get_bd_pins fanout_aresetn_pcie_slr2_1/d] [get_bd_pins fanout_aresetn_pcie_slr3_1/d]
connect_bd_net -net aresetn_pcie_slr0 [get_bd_pins fanout_aresetn_pcie_slr0_4/q] [get_bd_pins aresetn_pcie_slr0]
connect_bd_net -net aresetn_pcie_slr0_2 [get_bd_pins fanout_aresetn_pcie_slr0_1/q] [get_bd_pins fanout_aresetn_pcie_slr0_2/d]
connect_bd_net -net aresetn_pcie_slr0_3 [get_bd_pins fanout_aresetn_pcie_slr0_2/q] [get_bd_pins fanout_aresetn_pcie_slr0_3/d]
connect_bd_net -net aresetn_pcie_slr0_4 [get_bd_pins fanout_aresetn_pcie_slr0_3/q] [get_bd_pins fanout_aresetn_pcie_slr0_4/d]
connect_bd_net -net aresetn_pcie_slr1 [get_bd_pins fanout_aresetn_pcie_slr1_4/q] [get_bd_pins aresetn_pcie_slr1]
connect_bd_net -net aresetn_pcie_slr1_2 [get_bd_pins fanout_aresetn_pcie_slr1_1/q] [get_bd_pins fanout_aresetn_pcie_slr1_2/d]
connect_bd_net -net aresetn_pcie_slr1_3 [get_bd_pins fanout_aresetn_pcie_slr1_2/q] [get_bd_pins fanout_aresetn_pcie_slr1_3/d]
connect_bd_net -net aresetn_pcie_slr1_4 [get_bd_pins fanout_aresetn_pcie_slr1_3/q] [get_bd_pins fanout_aresetn_pcie_slr1_4/d]
connect_bd_net -net aresetn_pcie_slr2 [get_bd_pins fanout_aresetn_pcie_slr2_4/q] [get_bd_pins aresetn_pcie_slr2]
connect_bd_net -net aresetn_pcie_slr2_2 [get_bd_pins fanout_aresetn_pcie_slr2_1/q] [get_bd_pins fanout_aresetn_pcie_slr2_2/d]
connect_bd_net -net aresetn_pcie_slr2_3 [get_bd_pins fanout_aresetn_pcie_slr2_2/q] [get_bd_pins fanout_aresetn_pcie_slr2_3/d]
connect_bd_net -net aresetn_pcie_slr2_4 [get_bd_pins fanout_aresetn_pcie_slr2_3/q] [get_bd_pins fanout_aresetn_pcie_slr2_4/d]
connect_bd_net -net aresetn_pcie_slr3 [get_bd_pins fanout_aresetn_pcie_slr3_6/q] [get_bd_pins aresetn_pcie_slr3]
connect_bd_net -net aresetn_pcie_slr3_2 [get_bd_pins fanout_aresetn_pcie_slr3_1/q] [get_bd_pins fanout_aresetn_pcie_slr3_2/d]
connect_bd_net -net aresetn_pcie_slr3_3 [get_bd_pins fanout_aresetn_pcie_slr3_2/q] [get_bd_pins fanout_aresetn_pcie_slr3_3/d]
connect_bd_net -net aresetn_pcie_slr3_4 [get_bd_pins fanout_aresetn_pcie_slr3_3/q] [get_bd_pins fanout_aresetn_pcie_slr3_4/d]
connect_bd_net -net aresetn_pcie_slr3_5 [get_bd_pins fanout_aresetn_pcie_slr3_4/q] [get_bd_pins fanout_aresetn_pcie_slr3_5/d]
connect_bd_net -net aresetn_pcie_slr3_6 [get_bd_pins fanout_aresetn_pcie_slr3_5/q] [get_bd_pins fanout_aresetn_pcie_slr3_6/d]
connect_bd_net -net vcc_net [get_bd_pins vcc/dout] \
  [get_bd_pins fanout_aresetn_pcie_slr0_1/resetn] [get_bd_pins fanout_aresetn_pcie_slr0_2/resetn] \
  [get_bd_pins fanout_aresetn_pcie_slr0_3/resetn] [get_bd_pins fanout_aresetn_pcie_slr0_4/resetn] \
  [get_bd_pins fanout_aresetn_pcie_slr1_1/resetn] [get_bd_pins fanout_aresetn_pcie_slr1_2/resetn] \
  [get_bd_pins fanout_aresetn_pcie_slr1_3/resetn] [get_bd_pins fanout_aresetn_pcie_slr1_4/resetn] \
  [get_bd_pins fanout_aresetn_pcie_slr2_1/resetn] [get_bd_pins fanout_aresetn_pcie_slr2_2/resetn] \
  [get_bd_pins fanout_aresetn_pcie_slr2_3/resetn] [get_bd_pins fanout_aresetn_pcie_slr2_4/resetn] \
  [get_bd_pins fanout_aresetn_pcie_slr3_1/resetn] [get_bd_pins fanout_aresetn_pcie_slr3_2/resetn] \
  [get_bd_pins fanout_aresetn_pcie_slr3_3/resetn] [get_bd_pins fanout_aresetn_pcie_slr3_4/resetn] \
  [get_bd_pins fanout_aresetn_pcie_slr3_5/resetn] [get_bd_pins fanout_aresetn_pcie_slr3_6/resetn]

current_bd_instance /fanout_aresetn_ctrl
connect_bd_net -net aclk_ctrl_net [get_bd_pins aclk_ctrl] \
  [get_bd_pins fanout_aresetn_ctrl_slr0_1/clk] [get_bd_pins fanout_aresetn_ctrl_slr0_2/clk] \
  [get_bd_pins fanout_aresetn_ctrl_slr0_3/clk] [get_bd_pins fanout_aresetn_ctrl_slr0_4/clk] \
  [get_bd_pins fanout_aresetn_ctrl_slr1_1/clk] [get_bd_pins fanout_aresetn_ctrl_slr1_2/clk] \
  [get_bd_pins fanout_aresetn_ctrl_slr1_3/clk] [get_bd_pins fanout_aresetn_ctrl_slr1_4/clk] \
  [get_bd_pins fanout_aresetn_ctrl_slr2_1/clk] [get_bd_pins fanout_aresetn_ctrl_slr2_2/clk] \
  [get_bd_pins fanout_aresetn_ctrl_slr2_3/clk] [get_bd_pins fanout_aresetn_ctrl_slr2_4/clk] \
  [get_bd_pins fanout_aresetn_ctrl_slr3_1/clk] [get_bd_pins fanout_aresetn_ctrl_slr3_2/clk] \
  [get_bd_pins fanout_aresetn_ctrl_slr3_3/clk] [get_bd_pins fanout_aresetn_ctrl_slr3_4/clk] \
  [get_bd_pins fanout_aresetn_ctrl_slr3_5/clk] [get_bd_pins fanout_aresetn_ctrl_slr3_6/clk]
connect_bd_net -net aresetn_ctrl_net [get_bd_pins aresetn_ctrl] \
  [get_bd_pins fanout_aresetn_ctrl_slr0_1/d] [get_bd_pins fanout_aresetn_ctrl_slr1_1/d] \
  [get_bd_pins fanout_aresetn_ctrl_slr2_1/d] [get_bd_pins fanout_aresetn_ctrl_slr3_1/d]
connect_bd_net -net aresetn_ctrl_slr0 [get_bd_pins fanout_aresetn_ctrl_slr0_4/q] [get_bd_pins aresetn_ctrl_slr0]
connect_bd_net -net aresetn_ctrl_slr0_2 [get_bd_pins fanout_aresetn_ctrl_slr0_1/q] [get_bd_pins fanout_aresetn_ctrl_slr0_2/d]
connect_bd_net -net aresetn_ctrl_slr0_3 [get_bd_pins fanout_aresetn_ctrl_slr0_2/q] [get_bd_pins fanout_aresetn_ctrl_slr0_3/d]
connect_bd_net -net aresetn_ctrl_slr0_4 [get_bd_pins fanout_aresetn_ctrl_slr0_3/q] [get_bd_pins fanout_aresetn_ctrl_slr0_4/d]
connect_bd_net -net aresetn_ctrl_slr1 [get_bd_pins fanout_aresetn_ctrl_slr1_4/q] [get_bd_pins aresetn_ctrl_slr1]
connect_bd_net -net aresetn_ctrl_slr1_2 [get_bd_pins fanout_aresetn_ctrl_slr1_1/q] [get_bd_pins fanout_aresetn_ctrl_slr1_2/d]
connect_bd_net -net aresetn_ctrl_slr1_3 [get_bd_pins fanout_aresetn_ctrl_slr1_2/q] [get_bd_pins fanout_aresetn_ctrl_slr1_3/d]
connect_bd_net -net aresetn_ctrl_slr1_4 [get_bd_pins fanout_aresetn_ctrl_slr1_3/q] [get_bd_pins fanout_aresetn_ctrl_slr1_4/d]
connect_bd_net -net aresetn_ctrl_slr2 [get_bd_pins fanout_aresetn_ctrl_slr2_4/q] [get_bd_pins aresetn_ctrl_slr2]
connect_bd_net -net aresetn_ctrl_slr2_2 [get_bd_pins fanout_aresetn_ctrl_slr2_1/q] [get_bd_pins fanout_aresetn_ctrl_slr2_2/d]
connect_bd_net -net aresetn_ctrl_slr2_3 [get_bd_pins fanout_aresetn_ctrl_slr2_2/q] [get_bd_pins fanout_aresetn_ctrl_slr2_3/d]
connect_bd_net -net aresetn_ctrl_slr2_4 [get_bd_pins fanout_aresetn_ctrl_slr2_3/q] [get_bd_pins fanout_aresetn_ctrl_slr2_4/d]
connect_bd_net -net aresetn_ctrl_slr3 [get_bd_pins fanout_aresetn_ctrl_slr3_6/q] [get_bd_pins aresetn_ctrl_slr3]
connect_bd_net -net aresetn_ctrl_slr3_2 [get_bd_pins fanout_aresetn_ctrl_slr3_1/q] [get_bd_pins fanout_aresetn_ctrl_slr3_2/d]
connect_bd_net -net aresetn_ctrl_slr3_3 [get_bd_pins fanout_aresetn_ctrl_slr3_2/q] [get_bd_pins fanout_aresetn_ctrl_slr3_3/d]
connect_bd_net -net aresetn_ctrl_slr3_4 [get_bd_pins fanout_aresetn_ctrl_slr3_3/q] [get_bd_pins fanout_aresetn_ctrl_slr3_4/d]
connect_bd_net -net aresetn_ctrl_slr3_5 [get_bd_pins fanout_aresetn_ctrl_slr3_4/q] [get_bd_pins fanout_aresetn_ctrl_slr3_5/d]
connect_bd_net -net aresetn_ctrl_slr3_6 [get_bd_pins fanout_aresetn_ctrl_slr3_5/q] [get_bd_pins fanout_aresetn_ctrl_slr3_6/d]
connect_bd_net -net vcc_net [get_bd_pins vcc/dout] \
  [get_bd_pins fanout_aresetn_ctrl_slr0_1/resetn] [get_bd_pins fanout_aresetn_ctrl_slr0_2/resetn] \
  [get_bd_pins fanout_aresetn_ctrl_slr0_3/resetn] [get_bd_pins fanout_aresetn_ctrl_slr0_4/resetn] \
  [get_bd_pins fanout_aresetn_ctrl_slr1_1/resetn] [get_bd_pins fanout_aresetn_ctrl_slr1_2/resetn] \
  [get_bd_pins fanout_aresetn_ctrl_slr1_3/resetn] [get_bd_pins fanout_aresetn_ctrl_slr1_4/resetn] \
  [get_bd_pins fanout_aresetn_ctrl_slr2_1/resetn] [get_bd_pins fanout_aresetn_ctrl_slr2_2/resetn] \
  [get_bd_pins fanout_aresetn_ctrl_slr2_3/resetn] [get_bd_pins fanout_aresetn_ctrl_slr2_4/resetn] \
  [get_bd_pins fanout_aresetn_ctrl_slr3_1/resetn] [get_bd_pins fanout_aresetn_ctrl_slr3_2/resetn] \
  [get_bd_pins fanout_aresetn_ctrl_slr3_3/resetn] [get_bd_pins fanout_aresetn_ctrl_slr3_4/resetn] \
  [get_bd_pins fanout_aresetn_ctrl_slr3_5/resetn] [get_bd_pins fanout_aresetn_ctrl_slr3_6/resetn]

current_bd_instance /frequency_counters
connect_bd_intf_net [get_bd_intf_pins S_AXI] [get_bd_intf_pins axi_ic_ctrl_mgmt_freq/S00_AXI]
connect_bd_intf_net [get_bd_intf_pins axi_ic_ctrl_mgmt_freq/M00_AXI] [get_bd_intf_pins frequency_counter_aclk_kernel_00/S_AXI]
connect_bd_intf_net [get_bd_intf_pins axi_ic_ctrl_mgmt_freq/M01_AXI] [get_bd_intf_pins frequency_counter_aclk_kernel_01/S_AXI]
connect_bd_intf_net [get_bd_intf_pins axi_ic_ctrl_mgmt_freq/M02_AXI] [get_bd_intf_pins frequency_counter_aclk/S_AXI]
connect_bd_net -net aclk_ctrl_net [get_bd_pins aclk_ctrl] [get_bd_pins axi_ic_ctrl_mgmt_freq/S00_ACLK] [get_bd_pins frequency_counter_aclk/test_clk0]
connect_bd_net -net aclk_freerun_net [get_bd_pins aclk_freerun] \
  [get_bd_pins axi_ic_ctrl_mgmt_freq/ACLK] [get_bd_pins axi_ic_ctrl_mgmt_freq/M00_ACLK] \
  [get_bd_pins axi_ic_ctrl_mgmt_freq/M01_ACLK] [get_bd_pins axi_ic_ctrl_mgmt_freq/M02_ACLK] \
  [get_bd_pins frequency_counter_aclk/s_axi_aclk] [get_bd_pins psreset_aclk_freerun/slowest_sync_clk] \
  [get_bd_pins frequency_counter_aclk_kernel_00/s_axi_aclk] [get_bd_pins frequency_counter_aclk_kernel_01/s_axi_aclk]
connect_bd_net -net aclk_pcie_net [get_bd_pins aclk_pcie] [get_bd_pins frequency_counter_aclk/test_clk1]
connect_bd_net -net aresetn_aclk_freerun_net [get_bd_pins psreset_aclk_freerun/interconnect_aresetn] \
  [get_bd_pins axi_ic_ctrl_mgmt_freq/ARESETN] [get_bd_pins axi_ic_ctrl_mgmt_freq/M00_ARESETN] \
  [get_bd_pins axi_ic_ctrl_mgmt_freq/M01_ARESETN] [get_bd_pins axi_ic_ctrl_mgmt_freq/M02_ARESETN] \
  [get_bd_pins frequency_counter_aclk/s_axi_aresetn] [get_bd_pins frequency_counter_aclk_kernel_00/s_axi_aresetn] \
  [get_bd_pins frequency_counter_aclk_kernel_01/s_axi_aresetn]
connect_bd_net -net aresetn_ctrl_net [get_bd_pins aresetn_ctrl] \
  [get_bd_pins axi_ic_ctrl_mgmt_freq/S00_ARESETN] [get_bd_pins psreset_aclk_freerun/ext_reset_in]
connect_bd_net -net clk_kernel_00_cont_net [get_bd_pins aclk_kernel_00_cont] [get_bd_pins frequency_counter_aclk_kernel_00/test_clk0]
connect_bd_net -net clk_kernel_00_net [get_bd_pins aclk_kernel_00] [get_bd_pins frequency_counter_aclk_kernel_00/test_clk1]
connect_bd_net -net clk_kernel_01_cont_net [get_bd_pins aclk_kernel_01_cont] [get_bd_pins frequency_counter_aclk_kernel_01/test_clk0]
connect_bd_net -net clk_kernel_01_net [get_bd_pins aclk_kernel_01] [get_bd_pins frequency_counter_aclk_kernel_01/test_clk1]

current_bd_instance /aclk_kernel_00_hierarchy
connect_bd_intf_net [get_bd_intf_pins S_AXI] [get_bd_intf_pins clkwiz_aclk_kernel_00/s_axi_lite]
connect_bd_net -net aclk_ctrl_net [get_bd_pins aclk_ctrl] [get_bd_pins clkwiz_aclk_kernel_00/s_axi_aclk]
connect_bd_net -net aclk_freerun_net [get_bd_pins aclk_freerun] [get_bd_pins clkwiz_aclk_kernel_00/clk_in1]
connect_bd_net -net aresetn_ctrl_net [get_bd_pins aresetn_ctrl] \
  [get_bd_pins clkwiz_aclk_kernel_00/s_axi_aresetn] [get_bd_pins clock_throttling_aclk_kernel_00/Rst_In]
connect_bd_net -net aresetn_kernel_00_async_net [get_bd_pins clock_throttling_aclk_kernel_00/Rst_Async] [get_bd_pins psreset_kernel_00/aux_reset_in]
connect_bd_net -net aresetn_pcie_net [get_bd_pins aresetn_pcie] [get_bd_pins psreset_kernel_00/ext_reset_in]
connect_bd_net -net clk_kernel_00_cont_net [get_bd_pins aclk_kernel_00_cont_adapt/clk_out] \
  [get_bd_pins fanout_aresetn_kernel_00/aclk_kernel_00_cont] [get_bd_pins psreset_kernel_00/slowest_sync_clk] \
  [get_bd_pins aclk_kernel_00_cont]
connect_bd_net -net clk_kernel_00_locked_net [get_bd_pins clkwiz_aclk_kernel_00/locked] [get_bd_pins clock_throttling_aclk_kernel_00/Locked]
connect_bd_net -net clk_kernel_00_net [get_bd_pins aclk_kernel_00_adapt/clk_out] [get_bd_pins aclk_kernel_00]
connect_bd_net -net clk_kernel_00_unbuffered_net [get_bd_pins clkwiz_aclk_kernel_00/clk_out1] [get_bd_pins clock_throttling_aclk_kernel_00/Clk_In]
connect_bd_net -net clock_throttling_kernel_00_clk_out_cont_net [get_bd_pins clock_throttling_aclk_kernel_00/Clk_Out_Cont] \
  [get_bd_pins aclk_kernel_00_cont_adapt/clk_in]
connect_bd_net -net clock_throttling_kernel_00_clk_out_net [get_bd_pins clock_throttling_aclk_kernel_00/Clk_Out] \
  [get_bd_pins aclk_kernel_00_adapt/clk_in]
connect_bd_net -net fanout_aresetn_kernel_00_slr0_net [get_bd_pins fanout_aresetn_kernel_00/aresetn_kernel_00_slr0] \
  [get_bd_pins aresetn_kernel_00_slr0]
connect_bd_net -net fanout_aresetn_kernel_00_slr1_net [get_bd_pins fanout_aresetn_kernel_00/aresetn_kernel_00_slr1] \
  [get_bd_pins aresetn_kernel_00_slr1]
connect_bd_net -net fanout_aresetn_kernel_00_slr2_net [get_bd_pins fanout_aresetn_kernel_00/aresetn_kernel_00_slr2] \
  [get_bd_pins aresetn_kernel_00_slr2]
connect_bd_net -net fanout_aresetn_kernel_00_slr3_net [get_bd_pins fanout_aresetn_kernel_00/aresetn_kernel_00_slr3] \
  [get_bd_pins aresetn_kernel_00_slr3]
connect_bd_net -net gapping_demand_net [get_bd_pins requested_gapping_demand_rate] [get_bd_pins clock_throttling_aclk_kernel_00/Rate_In]
connect_bd_net -net gapping_demand_toggle_net [get_bd_pins gapping_demand_toggle] [get_bd_pins clock_throttling_aclk_kernel_00/Rate_Upd_Tog]
connect_bd_net -net power_down_net [get_bd_pins power_down] [get_bd_pins clkwiz_aclk_kernel_00/power_down]
connect_bd_net -net psreset_kernel_00_net [get_bd_pins psreset_kernel_00/interconnect_aresetn] \
  [get_bd_pins fanout_aresetn_kernel_00/aresetn_kernel_00]
connect_bd_net -net shutdown_request_latched_net [get_bd_pins shutdown_request_latch] [get_bd_pins clock_throttling_aclk_kernel_00/Shutdown_Latch]
connect_bd_net -net startup_done_net [get_bd_pins clock_program_done] [get_bd_pins clock_throttling_aclk_kernel_00/Startup_Done]

current_bd_instance /aclk_kernel_00_hierarchy/fanout_aresetn_kernel_00
connect_bd_net -net aresetn_kernel_00_net [get_bd_pins aresetn_kernel_00] \
  [get_bd_pins fanout_aresetn_kernel_00_slr0_1/d] [get_bd_pins fanout_aresetn_kernel_00_slr1_1/d] \
  [get_bd_pins fanout_aresetn_kernel_00_slr2_1/d] [get_bd_pins fanout_aresetn_kernel_00_slr3_1/d]
connect_bd_net -net aresetn_kernel_00_slr0 [get_bd_pins fanout_aresetn_kernel_00_slr0_4/q] [get_bd_pins aresetn_kernel_00_slr0]
connect_bd_net -net aresetn_kernel_00_slr0_2 [get_bd_pins fanout_aresetn_kernel_00_slr0_1/q] [get_bd_pins fanout_aresetn_kernel_00_slr0_2/d]
connect_bd_net -net aresetn_kernel_00_slr0_3 [get_bd_pins fanout_aresetn_kernel_00_slr0_2/q] [get_bd_pins fanout_aresetn_kernel_00_slr0_3/d]
connect_bd_net -net aresetn_kernel_00_slr0_4 [get_bd_pins fanout_aresetn_kernel_00_slr0_3/q] [get_bd_pins fanout_aresetn_kernel_00_slr0_4/d]
connect_bd_net -net aresetn_kernel_00_slr1 [get_bd_pins fanout_aresetn_kernel_00_slr1_4/q] [get_bd_pins aresetn_kernel_00_slr1]
connect_bd_net -net aresetn_kernel_00_slr1_2 [get_bd_pins fanout_aresetn_kernel_00_slr1_1/q] [get_bd_pins fanout_aresetn_kernel_00_slr1_2/d]
connect_bd_net -net aresetn_kernel_00_slr1_3 [get_bd_pins fanout_aresetn_kernel_00_slr1_2/q] [get_bd_pins fanout_aresetn_kernel_00_slr1_3/d]
connect_bd_net -net aresetn_kernel_00_slr1_4 [get_bd_pins fanout_aresetn_kernel_00_slr1_3/q] [get_bd_pins fanout_aresetn_kernel_00_slr1_4/d]
connect_bd_net -net aresetn_kernel_00_slr2 [get_bd_pins fanout_aresetn_kernel_00_slr2_4/q] [get_bd_pins aresetn_kernel_00_slr2]
connect_bd_net -net aresetn_kernel_00_slr2_2 [get_bd_pins fanout_aresetn_kernel_00_slr2_1/q] [get_bd_pins fanout_aresetn_kernel_00_slr2_2/d]
connect_bd_net -net aresetn_kernel_00_slr2_3 [get_bd_pins fanout_aresetn_kernel_00_slr2_2/q] [get_bd_pins fanout_aresetn_kernel_00_slr2_3/d]
connect_bd_net -net aresetn_kernel_00_slr2_4 [get_bd_pins fanout_aresetn_kernel_00_slr2_3/q] [get_bd_pins fanout_aresetn_kernel_00_slr2_4/d]
connect_bd_net -net aresetn_kernel_00_slr3 [get_bd_pins fanout_aresetn_kernel_00_slr3_6/q] [get_bd_pins aresetn_kernel_00_slr3]
connect_bd_net -net aresetn_kernel_00_slr3_2 [get_bd_pins fanout_aresetn_kernel_00_slr3_1/q] [get_bd_pins fanout_aresetn_kernel_00_slr3_2/d]
connect_bd_net -net aresetn_kernel_00_slr3_3 [get_bd_pins fanout_aresetn_kernel_00_slr3_2/q] [get_bd_pins fanout_aresetn_kernel_00_slr3_3/d]
connect_bd_net -net aresetn_kernel_00_slr3_4 [get_bd_pins fanout_aresetn_kernel_00_slr3_3/q] [get_bd_pins fanout_aresetn_kernel_00_slr3_4/d]
connect_bd_net -net aresetn_kernel_00_slr3_5 [get_bd_pins fanout_aresetn_kernel_00_slr3_4/q] [get_bd_pins fanout_aresetn_kernel_00_slr3_5/d]
connect_bd_net -net aresetn_kernel_00_slr3_6 [get_bd_pins fanout_aresetn_kernel_00_slr3_5/q] [get_bd_pins fanout_aresetn_kernel_00_slr3_6/d]
connect_bd_net -net clk_kernel_cont [get_bd_pins aclk_kernel_00_cont] \
  [get_bd_pins fanout_aresetn_kernel_00_slr0_1/clk] [get_bd_pins fanout_aresetn_kernel_00_slr0_2/clk] \
  [get_bd_pins fanout_aresetn_kernel_00_slr0_3/clk] [get_bd_pins fanout_aresetn_kernel_00_slr0_4/clk] \
  [get_bd_pins fanout_aresetn_kernel_00_slr1_1/clk] [get_bd_pins fanout_aresetn_kernel_00_slr1_2/clk] \
  [get_bd_pins fanout_aresetn_kernel_00_slr1_3/clk] [get_bd_pins fanout_aresetn_kernel_00_slr1_4/clk] \
  [get_bd_pins fanout_aresetn_kernel_00_slr2_1/clk] [get_bd_pins fanout_aresetn_kernel_00_slr2_2/clk] \
  [get_bd_pins fanout_aresetn_kernel_00_slr2_3/clk] [get_bd_pins fanout_aresetn_kernel_00_slr2_4/clk] \
  [get_bd_pins fanout_aresetn_kernel_00_slr3_1/clk] [get_bd_pins fanout_aresetn_kernel_00_slr3_2/clk] \
  [get_bd_pins fanout_aresetn_kernel_00_slr3_3/clk] [get_bd_pins fanout_aresetn_kernel_00_slr3_4/clk] \
  [get_bd_pins fanout_aresetn_kernel_00_slr3_5/clk] [get_bd_pins fanout_aresetn_kernel_00_slr3_6/clk]
connect_bd_net -net vcc [get_bd_pins vcc/dout] \
  [get_bd_pins fanout_aresetn_kernel_00_slr0_1/resetn] [get_bd_pins fanout_aresetn_kernel_00_slr0_2/resetn] \
  [get_bd_pins fanout_aresetn_kernel_00_slr0_3/resetn] [get_bd_pins fanout_aresetn_kernel_00_slr0_4/resetn] \
  [get_bd_pins fanout_aresetn_kernel_00_slr1_1/resetn] [get_bd_pins fanout_aresetn_kernel_00_slr1_2/resetn] \
  [get_bd_pins fanout_aresetn_kernel_00_slr1_3/resetn] [get_bd_pins fanout_aresetn_kernel_00_slr1_4/resetn] \
  [get_bd_pins fanout_aresetn_kernel_00_slr2_1/resetn] [get_bd_pins fanout_aresetn_kernel_00_slr2_2/resetn] \
  [get_bd_pins fanout_aresetn_kernel_00_slr2_3/resetn] [get_bd_pins fanout_aresetn_kernel_00_slr2_4/resetn] \
  [get_bd_pins fanout_aresetn_kernel_00_slr3_1/resetn] [get_bd_pins fanout_aresetn_kernel_00_slr3_2/resetn] \
  [get_bd_pins fanout_aresetn_kernel_00_slr3_3/resetn] [get_bd_pins fanout_aresetn_kernel_00_slr3_4/resetn] \
  [get_bd_pins fanout_aresetn_kernel_00_slr3_5/resetn] [get_bd_pins fanout_aresetn_kernel_00_slr3_6/resetn]
